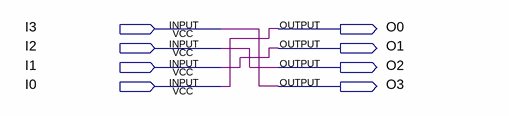
[diagram p0: schematic sheet]
// Quartus schematic 4InputOrderReverser.bdf as structural Verilog: 0 symbols, 8 pins
module \4InputOrderReverser  (
  input  I3,
  input  I2,
  input  I1,
  input  I0,
  output O0,
  output O1,
  output O2,
  output O3
);


  assign O0 = I0;
  assign O1 = I1;
  assign O2 = I2;
  assign O3 = I3;
endmodule
